# EAGLE design TSH82_Configurable_Op_Amp_Board (EAGLE 9.1.0)
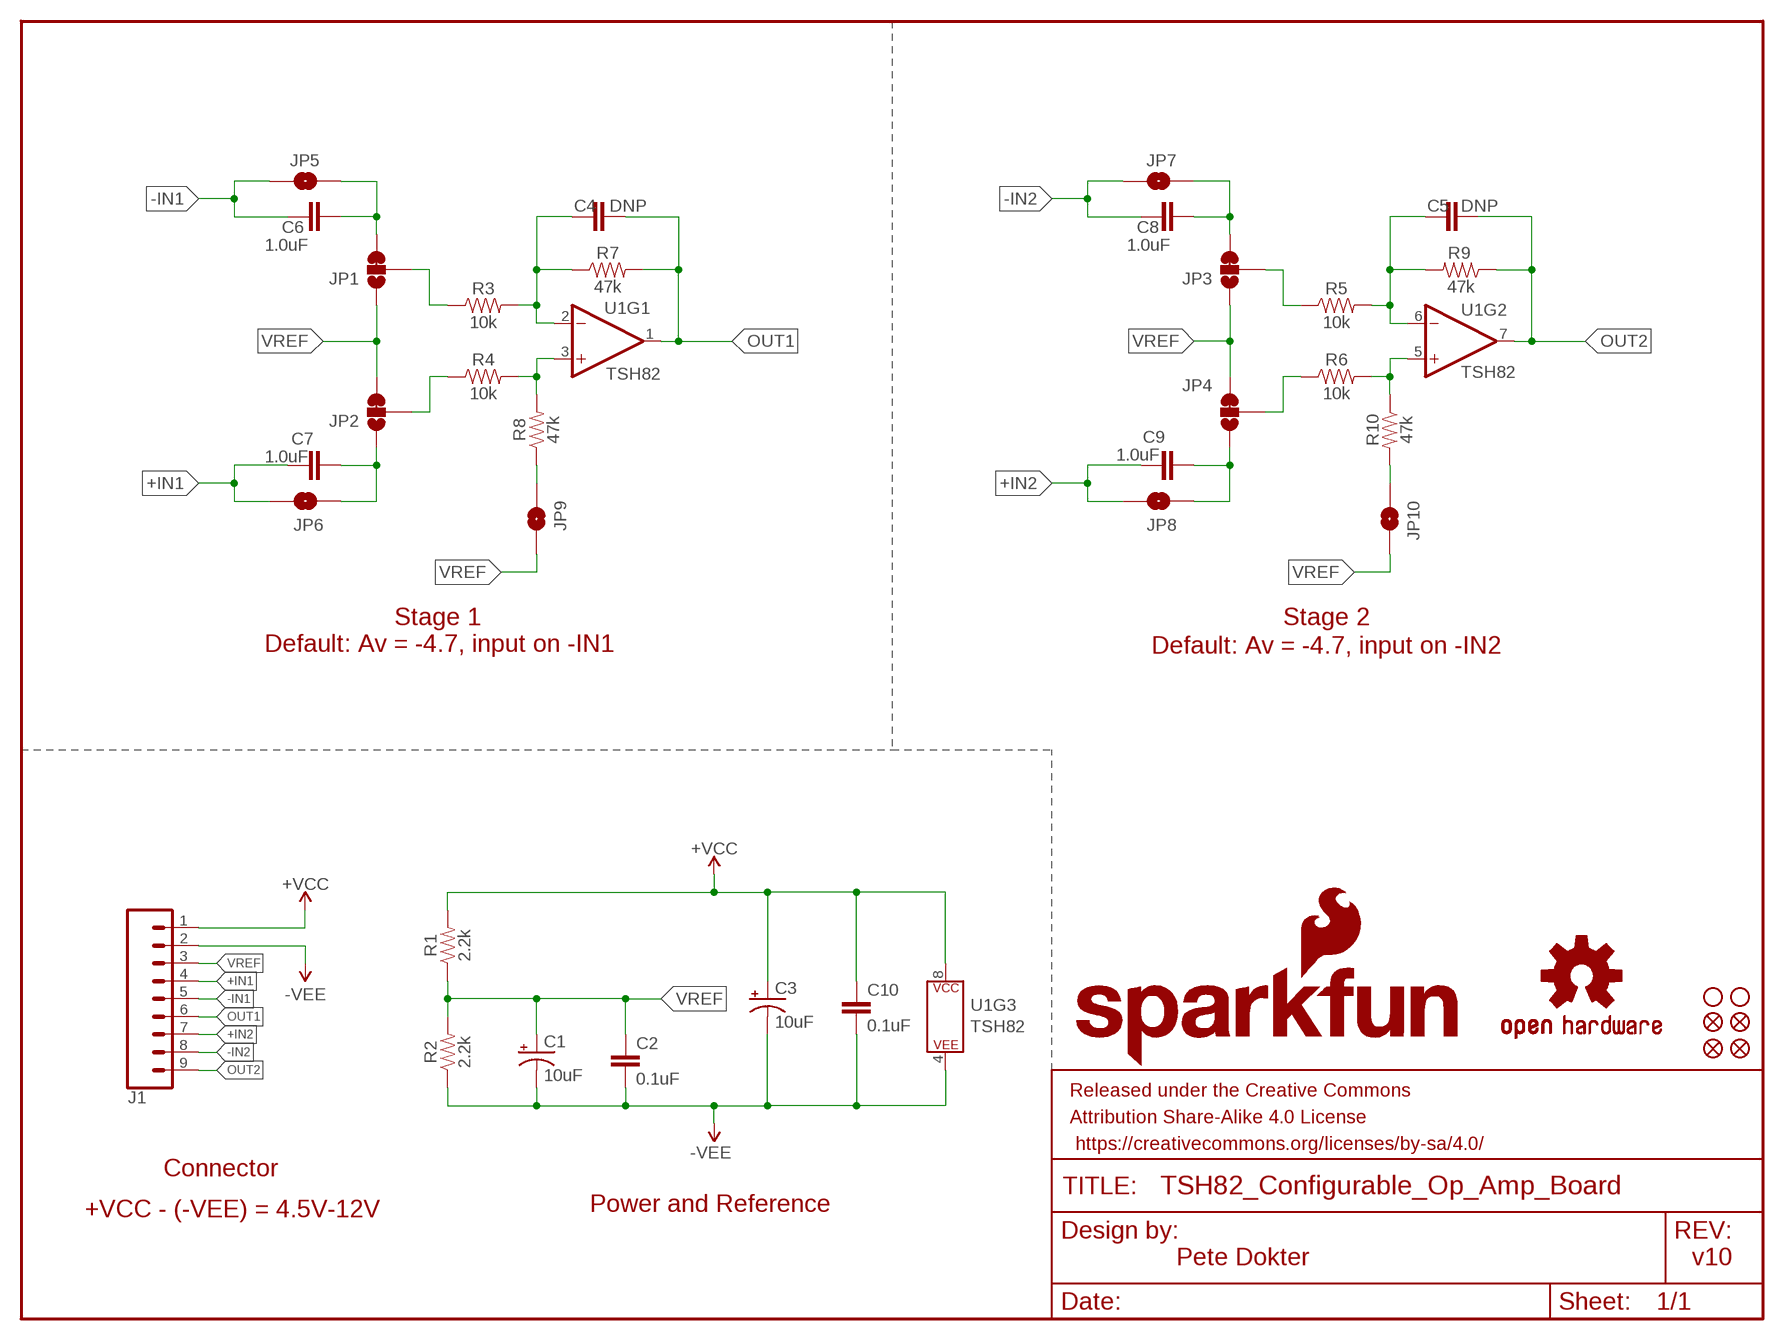
[diagram p0: schematic, sheet 1]

## Parts
C1  10uF  10UF-POLAR-EIA3216-16V-10%(TANT)  [EIA3216]
C2  0.1uF  0.1UF-0603-25V-(+80/-20%)  [0603]
C3  10uF  10UF-POLAR-EIA3216-16V-10%(TANT)  [EIA3216]
C4  DNP  1.0PF-0603-50V-25%  [0603]
C5  DNP  1.0PF-0603-50V-25%  [0603]
C6  1.0uF  1.0UF-0603-16V-10%  [0603]
C7  1.0uF  1.0UF-0603-16V-10%  [0603]
C8  1.0uF  1.0UF-0603-16V-10%  [0603]
C9  1.0uF  1.0UF-0603-16V-10%  [0603]
C10  0.1uF  0.1UF-0603-25V-(+80/-20%)  [0603]
FD1  FIDUCIALUFIDUCIAL  [FIDUCIAL-MICRO]
FD2  FIDUCIALUFIDUCIAL  [FIDUCIAL-MICRO]
FD3  FIDUCIALUFIDUCIAL  [FIDUCIAL-MICRO]
FD4  FIDUCIALUFIDUCIAL  [FIDUCIAL-MICRO]
FRAME1  FRAME-LETTER  [CREATIVE_COMMONS]
H1  STAND-OFF  [STAND-OFF]
H2  STAND-OFF  [STAND-OFF]
J1  CONN_09NO_SILK  [1X09_NO_SILK]
JP1  JUMPER-SMT_3_1-NC_TRACE_SILK  [SMT-JUMPER_3_1-NC_TRACE_SILK]
JP2  JUMPER-SMT_3_1-NC_TRACE_SILK  [SMT-JUMPER_3_1-NC_TRACE_SILK]
JP3  JUMPER-SMT_3_1-NC_TRACE_SILK  [SMT-JUMPER_3_1-NC_TRACE_SILK]
JP4  JUMPER-SMT_3_1-NC_TRACE_SILK  [SMT-JUMPER_3_1-NC_TRACE_SILK]
JP5  JUMPER-SMT_2_NO_SILK  [SMT-JUMPER_2_NO_SILK]
JP6  JUMPER-SMT_2_NO_SILK  [SMT-JUMPER_2_NO_SILK]
JP7  JUMPER-SMT_2_NO_SILK  [SMT-JUMPER_2_NO_SILK]
JP8  JUMPER-SMT_2_NO_SILK  [SMT-JUMPER_2_NO_SILK]
JP9  JUMPER-SMT_2_NO_SILK  [SMT-JUMPER_2_NO_SILK]
JP10  JUMPER-SMT_2_NO_SILK  [SMT-JUMPER_2_NO_SILK]
LOGO1  SFE_LOGO_FLAME.2_INCH  [SFE_LOGO_FLAME_.2]
LOGO2  SFE_LOGO_NAME_FLAME.1_INCH  [SFE_LOGO_NAME_FLAME_.1]
LOGO3  OSHW-LOGOS  [OSHW-LOGO-S]
R1  2.2k  2.2KOHM-0603-1/10W-1%  [0603]
R2  2.2k  2.2KOHM-0603-1/10W-1%  [0603]
R3  10k  10KOHM-0603-1/10W-1%  [0603]
R4  10k  10KOHM-0603-1/10W-1%  [0603]
R5  10k  10KOHM-0603-1/10W-1%  [0603]
R6  10k  10KOHM-0603-1/10W-1%  [0603]
R7  47k  47KOHM-0603-1/10W-1%  [0603]
R8  47k  47KOHM-0603-1/10W-1%  [0603]
R9  47k  47KOHM-0603-1/10W-1%  [0603]
R10  47k  47KOHM-0603-1/10W-1%  [0603]
U1  TSH82  [SO08]

## Nets
+IN1: C7.1 J1.4 JP6.2
+IN2: C9.1 J1.7 JP8.2
-IN1: C6.1 J1.5 JP5.2
-IN2: C8.1 J1.8 JP7.2
N$1: C4.1 R3.2 R7.1 U1.2(-IN)
N$2: R4.2 R8.2 U1.3(+IN)
N$3: JP9.1 R8.1
N$4: JP1.2 R3.1
N$5: JP2.2 R4.1
N$6: C6.2 JP1.3 JP5.1
N$7: C7.2 JP2.1 JP6.1
N$9: C8.2 JP3.3 JP7.1
N$10: JP3.2 R5.1
N$11: C5.1 R5.2 R9.2 U1.6(-IN)
N$16: JP4.2 R6.1
N$17: C9.2 JP4.1 JP8.1
N$19: R6.2 R10.1 U1.5(+IN)
N$20: JP10.1 R10.2
OUT1: C4.2 J1.6 R7.2 U1.1(OUT)
OUT2: C5.2 J1.9 R9.1 U1.7(OUT)
VCC: C3.+ C10.1 J1.1 R1.2 U1.8(P$V+) ; supply symbol labelled +VCC
VNEG: C1.- C2.2 C3.- C10.2 J1.2 R2.1 U1.4(P$V-) ; supply symbol labelled -VEE
VREF: C1.+ C2.1 J1.3 JP1.1 JP2.3 JP3.1 JP4.3 JP9.2 JP10.2 R1.1 R2.2

## Notes on the sheet
- Stage 1 | Stage 2
- Default: Av = -4.7, input on -IN1 | Default: Av = -4.7, input on -IN2
- Connector
- +VCC - (-VEE) = 4.5V-12V | Power and Reference
- Pete Dokter | v10

## Library data of the parts
C1 C3 = SparkFun-Capacitors:10UF-POLAR: 10.0µF polarized capacitors A capacitor is a passive two-terminal electrical component used to store electrical energy temporarily in an electric field.; PROD_ID: CAP-00811
C2 C10 = SparkFun-Capacitors:0.1UF: 0.1µF ceramic capacitors A capacitor is a passive two-terminal electrical component used to store electrical energy temporarily in an electric field.; PROD_ID: CAP-00810
C4 C5 = SparkFun-Capacitors:1.0PF: 1pF ceramic capacitors A capacitor is a passive two-terminal electrical component used to store electrical energy temporarily in an electric field.; PROD_ID: CAP-07879; VALUE: 1.0pF
C6-C9 = SparkFun-Capacitors:1.0UF: 1µF ceramic capacitors A capacitor is a passive two-terminal electrical component used to store electrical energy temporarily in an electric field.; PROD_ID: CAP-00868
FD1-FD4 = SparkFun-Aesthetics:FIDUCIAL: Fiducial Alignment Points Point-of-reference for pick-and-place machines and other optical instruments.
FRAME1 = SparkFun-Aesthetics:FRAME-LETTER: Schematic Frame - Letter Standard 8.5x11 US Letter frame
H1 H2 = SparkFun-Hardware:STAND-OFF: Stand Off Drill holes for mechanically mounting via screws, standoffs, etc. Note: Use the keepout ring to avoid running the screw head into surrounding components. Variant Overviews STAND-OFF - Mechanical footprint for a #4 phillips button head screw. STAND-OFF-TIGHT - Mechanical footprint for a #4 phillips button head screw, Example SparkFun Products Screw - Phillips Head (1/4", 4-40, 10 pack) <https://www.sparkfun.com/products/10453> (PRT-10453) Screw - Phillips Head (1/2", 4-40, 10 pack) <https://www.sparkfun.com/products/10452> (PRT-10452) Screw - Phillips Head (3/4", 4-40, 10 pack) <https://www.sparkfun.com/products/10451> (PRT-10451) Screw - Phillips Head (1", 4-40, 10 pack) <https://www.sparkfun.com/products/10450> (PRT-10450)
J1 = SparkFun-Connectors:CONN_09: Multi connection point. Often used as Generic Header-pin footprint for 0.1 inch spaced/style header connections On any of the 0.1 inch spaced packages, you can populate with these: Break Away Headers - Straight <https://www.sparkfun.com/products/116> (PRT-00116) Break Away Male Headers - Right Angle <https://www.sparkfun.com/products/553> (PRT-00553) Female Headers <https://www.sparkfun.com/products/115> (PRT-00115) Break Away Headers - Machine Pin <https://www.sparkfun.com/products/117> (PRT-00117) Break Away Female Headers - Swiss Machine Pin <https://www.sparkfun.com/products/743> (PRT-00743) For SCREWTERMINALS and SPRING TERMINALS visit here: Screw Terimnals on SparkFun.com <https://www.sparkfun.com/search/results?term=Screw+Terminals> (5mm/3.5mm/2.54mm spacing) This device is also useful as a general connection point to wire up your design to another part of your project. Our various solder wires solder well into these plated through hole pads. Hook-Up Wire - Assortment (Stranded, 22 AWG) <https://www.sparkfun.com/products/11375> (PRT-11375) Hook-Up Wire - Assortment (Solid Core, 22 AWG) <https://www.sparkfun.com/products/11367> (PRT-11367) View the entire wire category on our website here <https://www.sparkfun.com/categories/141> Special notes: Molex polarized connector foot print use with SKU : PRT-08231 with associated crimp pins and housings. 1MM SMD Version SKU: PRT-10208 NOTES ON THE VARIANTS LOCK and LOCK_LONGPADS... This footprint was designed to help hold the alignment of a through-hole component (i.e. 6-pin header) while soldering it into place. You may notice that each hole has been shifted either up or down by 0.005 of an inch from it's more standard position (which is a perfectly straight line). This slight alteration caused the pins (the squares in the middle) to touch the edges of the holes. Because they are alternating, it causes a "brace" to hold the component in place. 0.005 has proven to be the perfect amount of "off-center" position when using our standard breakaway headers. Although looks a little odd when you look at the bare footprint, once you have a header in there, the alteration is very hard to notice. Also,if you push a header all the way into place, it is covered up entirely on the bottom side.
JP1-JP4 = SparkFun-Jumpers:JUMPER-SMT_3_1-NC_TRACE: Normally closed trace jumper (1 of 2 connections) This jumper has a trace between two pads so it's normally closed (NC). The other connection is normally open (NO). Use a razor knife to open the connection. For best results follow the IPC guidelines for cutting traces: Cutout at least 0.063 mm (0.005 in). Remove all loose material to clean up the cut area. Seal the cut with an approved epoxy. Reapply solder to reclose the connection, or to close the NO connection.
JP5-JP10 = SparkFun-Jumpers:JUMPER-SMT_2_NO: Normally open jumper This jumper has two pads in close proximity to each other. Apply solder to close the connection. Round pads are easier to solder for beginners, but are a lot larger. SparkFun Product that uses the round pads: SparkFun EL Sequencer <https://www.sparkfun.com/products/12781>
LOGO1 = SparkFun-Aesthetics:SFE_LOGO_FLAME: SparkFun Flame Logo This is the SparkFun flame logo. The logo on the schematic will always be the same size; the package variant is the height of the flame. Default layer for the logo on the board is tSilk.
LOGO2 = SparkFun-Aesthetics:SFE_LOGO_NAME_FLAME: SparkFun Font Logo w/ Flame This is the SparkFun full logo. The logo on the schematic will always be the same size; the package variant is the height of the flame part of the logo. Default layer for the logo on the board is tSilk.
LOGO3 = SparkFun-Aesthetics:OSHW-LOGO: Open-Source Hardware (OSHW) Logo This logo indicates the piece of hardware it is found on incorporates a OSHW license and/or adheres to the definition of open source hardware found here: http://freedomdefined.org/OSHW
R1 R2 = SparkFun-Resistors:2.2KOHM: 2.2kΩ resistor A resistor is a passive two-terminal electrical component that implements electrical resistance as a circuit element. Resistors act to reduce current flow, and, at the same time, act to lower voltage levels within circuits. - Wikipedia; PROD_ID: RES-08272
R3-R6 = SparkFun-Resistors:10KOHM: 10kΩ resistor A resistor is a passive two-terminal electrical component that implements electrical resistance as a circuit element. Resistors act to reduce current flow, and, at the same time, act to lower voltage levels within circuits. - Wikipedia; PROD_ID: RES-00824
R7-R10 = SparkFun-Resistors:47KOHM: 47kΩ resistor A resistor is a passive two-terminal electrical component that implements electrical resistance as a circuit element. Resistors act to reduce current flow, and, at the same time, act to lower voltage levels within circuits. - Wikipedia; PROD_ID: RES-07871
U1 = SparkFun-IC-Amplifiers:TSH82: 65MHz dual op amp in a SOIC8 package.

## Board
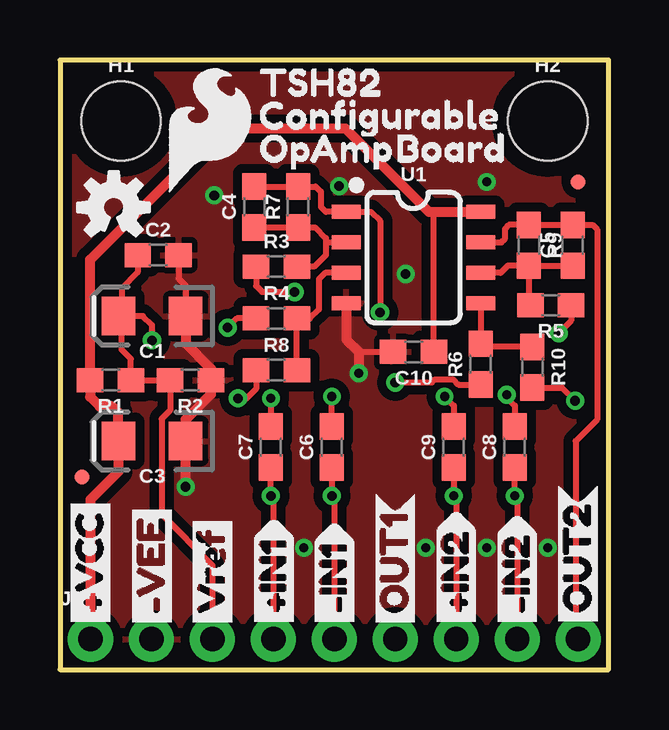
[diagram p1: board, top side]
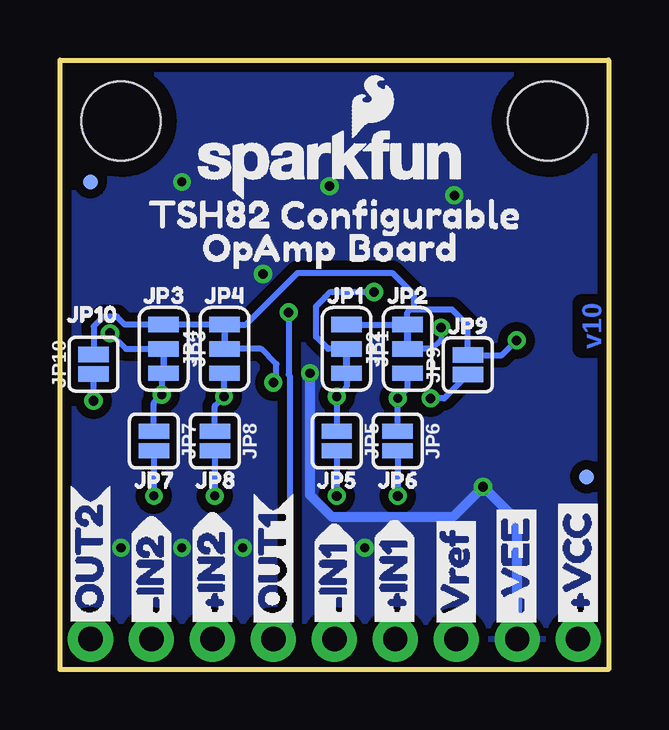
[diagram p2: board, bottom side, seen from below]

Size 22.86 x 25.4 mm. Coordinates in mm from the lower left corner, seen from the top.
Outline: 0,0 22.86,0 22.86,25.4 0,25.4 0,0
Copper layers (1*16): Top 0.035mm / dielectric 1.5mm / Bottom 0.035mm
Design rules "SparkFun-2-layer-TIGHT": minimum track width 7mil, minimum drill 15mil, track to track 7mil, track to pad 7mil, pad to pad 7mil, via to via 7mil, smd to smd 7mil, copper to edge 7mil, drill to drill 7mil, minimum pad ring 7mil, minimum via ring 7mil, stop-mask expansion 4mil, vias tented up to drill 25mil, thermal gap 10mil

### Footprints (pad centres in the part's own frame; a part is rotated, then mirrored left to right if it is on the bottom)
EIA3216 = smd 1.4 x 1.6: + 1.4,0; - -1.4,0
0603 = smd 1.1 x 1: 1 -0.85,0; 2 0.85,0
FIDUCIAL-MICRO = smd 0.635 x 0.635: 1 0,0
STAND-OFF = hole 3.302: 0,0
1X09_NO_SILK = drill 1.016 pad 1.88: 1 0,0; 2 2.54,0; 3 5.08,0; 4 7.62,0; 5 10.16,0; 6 12.7,0; 7 15.24,0; 8 17.78,0; 9 20.32,0
SMT-JUMPER_3_1-NC_TRACE_SILK = smd 0.635 x 1.27: 1 -1.016,0; 2 0,0; 3 1.016,0
SMT-JUMPER_2_NO_SILK = smd 0.635 x 1.27: 1 -0.406,0; 2 0.406,0
SO08 = smd 0.6 x 1.2: 1 -1.905,-2.8; 2 -0.635,-2.8; 3 0.635,-2.8; 4 1.905,-2.8; 5 1.905,2.8; 6 0.635,2.8; 7 -0.635,2.8; 8 -1.905,2.8

### Placement (x,y rotation side)
C1  3.84,14.73 180 top
C2  4.09,17.27 0 top
C3  3.84,9.53 180 top
C4  8.1,19.28 90 top
C5  21.36,17.68 90 top
C6  11.33,9.27 90 top
C7  8.79,9.27 90 top
C8  18.95,9.27 90 top
C9  16.41,9.27 90 top
C10  14.73,13.23 180 top
FD1  21.59,20.32 0 top
FD2  0.91,8.03 0 top
FD3  0.91,8.03 0 bottom
FD4  21.59,20.32 0 bottom
FRAME1  -8.89,-10.16 0 top  (outside the outline)
H1  2.54,22.86 0 top
H2  20.32,22.86 0 top
J1  1.27,1.27 0 top
JP1  10.92,13.36 270 bottom
JP2  8.38,13.36 90 bottom
JP3  18.54,13.36 270 bottom
JP4  16,13.36 90 bottom
JP5  11.33,9.53 270 bottom
JP6  8.79,9.53 270 bottom
JP7  18.95,9.53 270 bottom
JP8  16.41,9.53 270 bottom
JP9  5.87,12.7 90 bottom
JP10  21.46,12.73 90 bottom
LOGO1  4.22,19.66 0 top
LOGO2  17.53,19.53 0 bottom
LOGO3  2.24,19.25 0 top
R1  2.11,12.06 180 top
R2  5.44,12.06 180 top
R3  9.02,16.79 0 top
R4  9.02,14.63 0 top
R5  20.45,15.19 180 top
R6  17.53,12.73 90 top
R7  9.93,19.28 90 top
R8  9.02,12.47 0 top
R9  19.53,17.68 270 top
R10  19.68,12.6 270 top
U1  14.73,17.17 270 top
U$1  [#VEE1]  3.84,1.42 90 top
U$2  [#VEE1]  3.84,1.42 90 bottom
U$3  [#VCC0]  1.27,1.47 90 top
U$4  [VREF6]  6.35,1.42 90 top
U$5  [VREF6]  6.35,1.42 90 bottom
U$6  [#IN12]  8.92,1.47 90 bottom
U$7  [#IN12]  8.92,1.47 90 top
U$8  [#IN13]  11.43,1.47 90 top
U$9  [#IN13]  11.43,1.47 90 bottom
U$10  [OUT17]  13.97,1.42 90 top
U$11  [OUT17]  13.97,1.42 90 bottom
U$12  [#IN24]  16.51,1.47 90 top
U$13  [#IN24]  16.51,1.47 90 bottom
U$14  [#IN25]  19.05,1.47 90 top
U$15  [OUT28]  21.59,1.45 90 top
U$16  [#IN25]  19.05,1.47 90 bottom
U$17  [OUT28]  21.59,1.45 90 bottom
U$18  [JP10]  12.4,15.65 0 bottom
U$19  [JP21]  9.93,15.65 0 bottom
U$20  [JP32]  20.09,15.65 0 bottom
U$21  [JP43]  17.53,15.65 0 bottom
U$22  [TSH820]  7.39,24.41 0 top
U$23  [CONFIGURABLE1]  7.39,23.04 0 top
U$24  [OPAMP2]  7.39,21.67 0 top
U$25  [BOARD3]  13.08,21.67 0 top
U$26  [TSH820]  20.09,18.92 0 bottom
U$27  [CONFIGURABLE1]  14.58,18.9 0 bottom
U$28  [OPAMP2]  17.86,17.53 0 bottom
U$29  [BOARD3]  11.79,17.53 0 bottom
U$30  [#VCC0]  1.27,1.47 90 bottom
U$31  [JP54]  12.83,7.95 0 bottom
U$32  [JP65]  10.31,7.95 0 bottom
U$33  [JP76]  20.47,7.95 0 bottom
U$34  [JP87]  17.91,7.95 0 bottom
U$35  [JP98]  7.39,14.38 0 bottom
U$36  [JP109]  23.27,14.86 0 bottom

### Tracks (layer width: path | path; a pad name or v marks a point on that pad's centre or on a via)
+IN1  (via drill 0.4 pad 0.55)
  Top 0.254: C7.1 v8.79,7.24 8.89,7.14 J1.4
  Bottom 0.254: JP6.2 v8.79,7.24
+IN2  (via drill 0.38)
  Top 0.254: C9.1 v16.41,7.24 16.51,7.14 J1.7
  Bottom 0.254: JP8.2 v16.41,7.24
-IN1  (via drill 0.4 pad 0.55)
  Top 0.254: C6.1 v11.33,7.24 11.43,7.14 J1.5
  Bottom 0.254: JP5.2 v11.33,7.24
-IN2  (via drill 0.38)
  Top 0.254: C8.1 v18.95,7.24 19.05,7.14 J1.8
  Bottom 0.254: JP7.2 v18.95,7.24
N$1
  Top 0.254: 11.07,17.8 U1.2 | R3.2 10.59,16.79 11.07,17.27 11.07,17.8 | C4.1 R7.1 10.63,18.43 11.07,17.98 11.07,17.8
N$2
  Top 0.254: U1.3 11.05,16.54 10.79,16.28 10.79,15.01 10.41,14.63 R4.2 R8.2
N$3  (via drill 0.4 pad 0.55)
  Top 0.254: R8.1 8.17,11.7 7.77,11.3 v7.42,11.3
  Bottom 0.254: JP9.1 6.86,11.3 v7.42,11.3
N$4  (via drill 0.4 pad 0.55)
  Top 0.254: R3.1 8.17,15.99 8.42,15.73 v9.78,15.73
  Bottom 0.254: JP1.2 11.68,13.36 12.19,13.87 12.19,15.14 11.81,15.52 11.6,15.73 v9.78,15.73
N$5  (via drill 0.4 pad 0.55)
  Top 0.254: R4.1 7.37,14.63 v6.99,14.25
  Bottom 0.254: v6.99,14.25 6.99,13.74 7.37,13.36 JP2.2
N$6  (via drill 0.38)
  Top 0.254: C6.2 v11.33,11.38
  Bottom 0.254: JP5.1 v11.33,11.38 10.92,11.79 JP1.3
N$7  (via drill 0.38)
  Top 0.254: v8.79,11.3 C7.2
  Bottom 0.254: JP6.1 v8.79,11.3 8.38,11.71 JP2.1
N$9  (via drill 0.38)
  Top 0.254: 18.98,10.15 C8.2 18.95,11 18.63,11.33 18.63,11.35 18.62,11.35 v18.62,11.46
  Bottom 0.254: 18.57,12.31 JP3.3 18.62,12.27 v18.62,11.46 18.95,11.12 JP7.1 18.98,9.96
N$10  (via drill 0.4 pad 0.55)
  Top 0.254: R5.1 21.3,14.54 v20.78,14.02
  Bottom 0.254: JP3.2 20.12,13.36 v20.78,14.02
N$11
  Top 0.254: U1.6 18.36,16.54 18.66,16.83 R9.2 | R9.2 19.53,15.25 R5.2 | R9.2 C5.1
N$16  (via drill 0.4 pad 0.55)
  Top 0.254: v13.97,11.96 15.49,11.96 15.62,12.09 16.38,12.09 16.6,11.88 R6.1
  Bottom 0.254: v13.97,11.96 13.84,12.09 13.84,12.72 14.48,13.36 JP4.2
N$17  (via drill 0.38)
  Top 0.254: v16.03,11.38 16.41,11 C9.2
  Bottom 0.254: JP8.1 16.41,11 v16.03,11.38 16.03,12.32 JP4.1
N$19
  Top 0.254: U1.5 17.53,13.45 | 17.53,13.45 R6.2 | R10.1 17.54,13.45 17.53,13.45
N$20  (via drill 0.4 pad 0.55)
  Top 0.254: R10.2 20.92,11.75 v21.46,11.2
  Bottom 0.254: v21.46,11.2 JP10.1
OUT1  (via drill 0.4 pad 0.55)
  Top 0.254: v13.34,14.88 13.34,18.69 12.95,19.07 U1.1 11.07,19.07 10.87,19.28 10.87,19.91 10.66,20.13 R7.2 C4.2
  Bottom 0.254: v13.34,14.88 13.34,12.29 13.29,12.25 13.29,1.95 J1.6
OUT2
  Top 0.254: U1.7 18.39,17.8 18.54,17.96 18.54,18.36 18.71,18.53 R9.1 C5.2 22.19,18.53 22.38,18.34 22.38,10.41 21.49,9.53 21.49,1.37 J1.9
VCC
  Top 0.254: C10.1 15.58,19.04 15.62,19.07
  Top 0.406: U1.8 15.62,19.07 15.37,19.07 11.89,22.55 6.73,22.55 1.26,17.08 R1.2 1.26,11.37 1.65,10.97 2.18,10.97 2.44,10.72 C3.+ 2.44,8.25 1.27,7.09 J1.1
VNEG  (via drill 0.38, 0.4, 0.4 pad 0.55)
  Top 0.254: 5.23,13.59 5.24,13.59 | C2.2 4.94,16.3 5.24,16 C1.- | 12.45,13.23 C10.2
  Top 0.406: C1.- 5.24,13.59 | U1.4 11.93,13.75 12.45,13.23 v12.45,12.34 | v5.23,7.62 C3.- 5.24,10.42 6.29,11.47 R2.1 6.29,12.54 5.23,13.59
  Bottom 0.406: J1.2 3.81,6.2 v5.23,7.62 6.5,6.35 11.51,6.35 12.45,7.28 v12.45,12.34
  other vias: 17.78,20.32 20.32,5.08 17.78,5.08 10.16,5.08 15.24,5.08 6.43,19.76 11.63,20.14 14.4,16.48
  pour Bottom (isolate 0.381): 0,0 22.86,0 22.86,25.4 0,25.4
  pour Top (isolate 0.381): 0,0 22.86,0 22.86,25.4 0,25.4
VREF  (via drill 0.4 pad 0.55)
  Top 0.254: C1.+ 2.56,14.86 2.56,15.88 3.24,16.55 C2.1 | C1.+ 2.56,14.6 2.56,13.34 2.96,12.94 R1.1 R2.2 4.59,10.81 4.23,10.45 4.23,6.46 6.35,4.34 J1.3 | v3.83,13.72 3.83,14.35 3.45,14.73 C1.+
  Bottom 0.254: v3.83,13.72 4.45,13.11 JP9.2 5.87,14.35 6.53,15.01 8,15.01 | 8,15.01 8.26,15.01 8.38,14.88 JP2.3 JP1.1 | JP4.3 15.88,14.5 | 8,15.01 8.13,15.14 8.13,15.65 9.02,16.54 12.95,16.54 15.11,14.38 JP4.3 | JP4.3 JP3.1 20.17,14.38 20.49,14.7 21.06,14.7 21.46,14.3 JP10.2

### Text on the board
Bottom: v10
tDocu: Pete Dokter